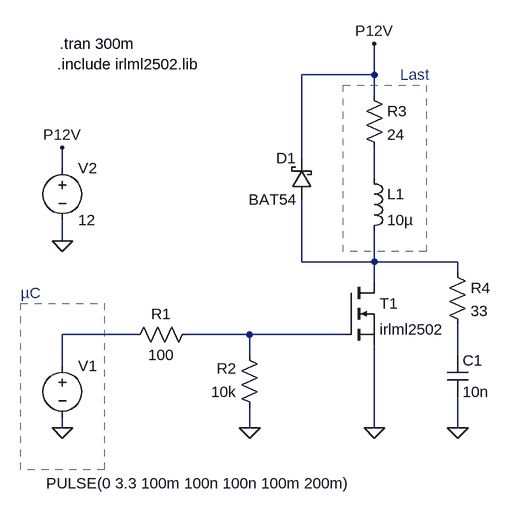
[diagram p0: schematic TransistorAlsSchalter.asc]
TransistorAlsSchalter.asc, the LTspice schematic file:
Version 4
SHEET 1 1072 680
WIRE 512 -352 512 -400
WIRE 512 -352 400 -352
WIRE 512 -320 512 -352
WIRE 400 -224 400 -352
WIRE 32 -208 32 -240
WIRE 512 -192 512 -240
WIRE 32 -96 32 -128
WIRE 400 -64 400 -160
WIRE 512 -64 512 -112
WIRE 512 -64 400 -64
WIRE 640 -64 512 -64
WIRE 640 -48 640 -64
WIRE 512 -32 512 -64
WIRE 144 48 32 48
WIRE 320 48 224 48
WIRE 464 48 320 48
WIRE 320 80 320 48
WIRE 640 80 640 32
WIRE 32 96 32 48
WIRE 32 192 32 176
WIRE 320 192 320 160
WIRE 512 192 512 64
WIRE 640 192 640 144
FLAG 32 192 0
FLAG 320 192 0
FLAG 512 192 0
FLAG 32 -96 0
FLAG 32 -240 P12V
FLAG 512 -400 P12V
FLAG 640 192 0
SYMBOL voltage 32 80 R0
WINDOW 3 -25 197 Left 2
WINDOW 123 0 0 Left 0
WINDOW 39 0 0 Left 0
SYMATTR InstName V1
SYMATTR Value PULSE(0 3.3 100m 100n 100n 100m 200m)
SYMBOL res 240 32 R90
WINDOW 0 0 56 VBottom 2
WINDOW 3 32 56 VTop 2
SYMATTR InstName R1
SYMATTR Value 100
SYMBOL res 336 176 R180
WINDOW 0 36 76 Left 2
WINDOW 3 36 40 Left 2
SYMATTR InstName R2
SYMATTR Value 10k
SYMBOL nmos 464 -32 R0
SYMATTR InstName T1
SYMATTR Value irlml2502
SYMATTR Prefix X
SYMBOL res 496 -336 R0
SYMATTR InstName R3
SYMATTR Value 24
SYMBOL ind 496 -208 R0
SYMATTR InstName L1
SYMATTR Value 10µ
SYMBOL voltage 32 -224 R0
WINDOW 123 0 0 Left 0
WINDOW 39 0 0 Left 0
SYMATTR InstName V2
SYMATTR Value 12
SYMBOL schottky 416 -160 R180
WINDOW 0 24 64 Left 2
WINDOW 3 24 0 Left 2
SYMATTR InstName D1
SYMATTR Value BAT54
SYMATTR Description Diode
SYMATTR Type diode
SYMBOL res 624 -64 R0
SYMATTR InstName R4
SYMATTR Value 33
SYMBOL cap 624 80 R0
SYMATTR InstName C1
SYMATTR Value 10n
TEXT 28 -400 Left 2 !.tran 300m
TEXT 24 -368 Left 2 !.include irlml2502.lib
TEXT -32 -16 Left 2 ;µC
TEXT 552 -352 Left 2 ;Last
RECTANGLE Normal 592 -80 464 -336 1
RECTANGLE Normal 96 256 -32 0 1

The netlist it stands for:
* TransistorAlsSchalter.asc
V1 N003 0 PULSE(0 3.3 100m 100n 100n 100m 200m)
R1 N004 N003 100
R2 0 N004 10k
XT1 N002 N004 0 irlml2502  ; pins D G S
R3 P12V N001 24
L1 N001 N002 10µ
V2 P12V 0 12
D1 N002 P12V BAT54
R4 N002 N005 33
C1 N005 0 10n
.model D D
.lib standard.dio
.tran 300m
.include irlml2502.lib
* µC
* Last
.backanno
.end